# Altium project Photocell circuit.PrjPcb
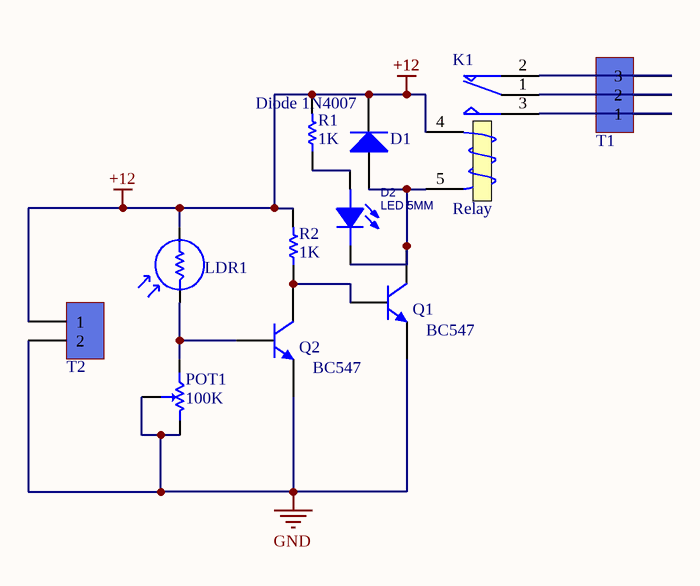
[diagram p0: Sheet1.SchDoc]
1 sheet, 11 parts. Net scope: global (net labels, ports and power ports of the same name join across sheets).
Board file: PCB1.PcbDoc

## Sheet Sheet1.SchDoc
size A

### Parts
D1  Diode 1N4007  [DO-41]
D2  LED 5MM  [LED5MM_BLUE]
K1  Relay  [Relay 15.40x12.10x13.10]
LDR1  PhotoCell  [PhotoCell]  (value not drawn)
POT1  100K  [POT]
Q1  BC547  [TO-92 STR]  (value not drawn)
Q2  BC547  [TO-92 STR]  (value not drawn)
R1  1K  [RES-(1/4)]
R2  1K  [RES-(1/4)]
T1  Terminal  [Terminal 1*3]  (value not drawn)
T2  Terminal  [Terminal 1*2]  (value not drawn)

### Nets
+12: D1.2(K) K1.4(T1) LDR1.2 R1.2 R2.2 T2.1
GND: POT1.2(CW) POT1.3(SetPoint) Q1.3(E) Q2.3(E) T2.2
NetD1_1: D1.1(A) D2.2(CATHODE) K1.5(T2) Q1.1(C)
NetD2_1: D2.1(ANODE) R1.1
NetK1_1: K1.1(COM) T1.2
NetK1_2: K1.2(NC) T1.3
NetK1_3: K1.3(NO) T1.1
NetLDR1_1: LDR1.1 POT1.1(CCW) Q2.2(B)
NetQ1_2: Q1.2(B) Q2.1(C) R2.1

### Notes on the sheet
- (near Q2) BC547
- (near Q1) BC547

### Library data of the parts
D1 = Diode 1N4007: 1 Amp General Purpose Rectifier; Published: 8-Jun-2000; LatestRevisionDate: 17-Jul-2002; LatestRevisionNote: Re-released for DXP Platform.; DatasheetVersion: 1998; PackageVersion: Aug-1999; PackageReference: DO-41; Publisher: Altium Limited; PackageDescription: Diode, Axial; Body 5.2 x 2.7 mm (LxDia. max), Lead Dia. 0.86 mm (max); Code_JEDEC: DO-204-AL; ComponentLink1Description: Manufacturer Link; ComponentLink1URL: http://www.fairchildsemi.com/; ComponentLink2Description: Datasheet; ComponentLink2URL: http://www.fairchildsemi.com/ds/1N%2F1N4001.pdf
D2 = LED 5MM: Light Emitting Diode; Designer: Abbas Basereh; Data: 16-12-2016; Link: *; Part.No: *
K1 = RELAY General: Relay_SPDT POWER NEEDLE; Designer: Ali Hafizi; Company: E.P.I.L; Design_Date: 2011/10/31
LDR1 = LDR: Photo Cell- Variable Resistor With Light; Company: IPA CO.; Designer: Saeid Jorablo; Last Update Time: 2008/07/17
POT1 = POT: Variable Resistor; Value: 100K
Q1 Q2 = BC547: NPN General-purpose Transistor; Designer: Abbas Basereh; Desc.: Plastic Medium-Power. Silicon NPN Transistors; Data: 27-12-2016
R1 R2 = RES DIP PACKAGE: TOTAL DIP RESISTOR PACK; Designer: Ali Hafizi
T1 = Terminal 1*3: Terminal 3 Pin 250VAC 16A; Designer: Seyed Mohsen Ghasemain; E-mail: picpars@gmail.com; ComponentLinkURL: www.picpars.com
T2 = Terminal 1*2: Terminal 2 Pin 250VAC 16A; Designer: Seyed Mohsen Ghasemain; E-mail: picpars@gmail.com; ComponentLinkURL: www.picpars.com